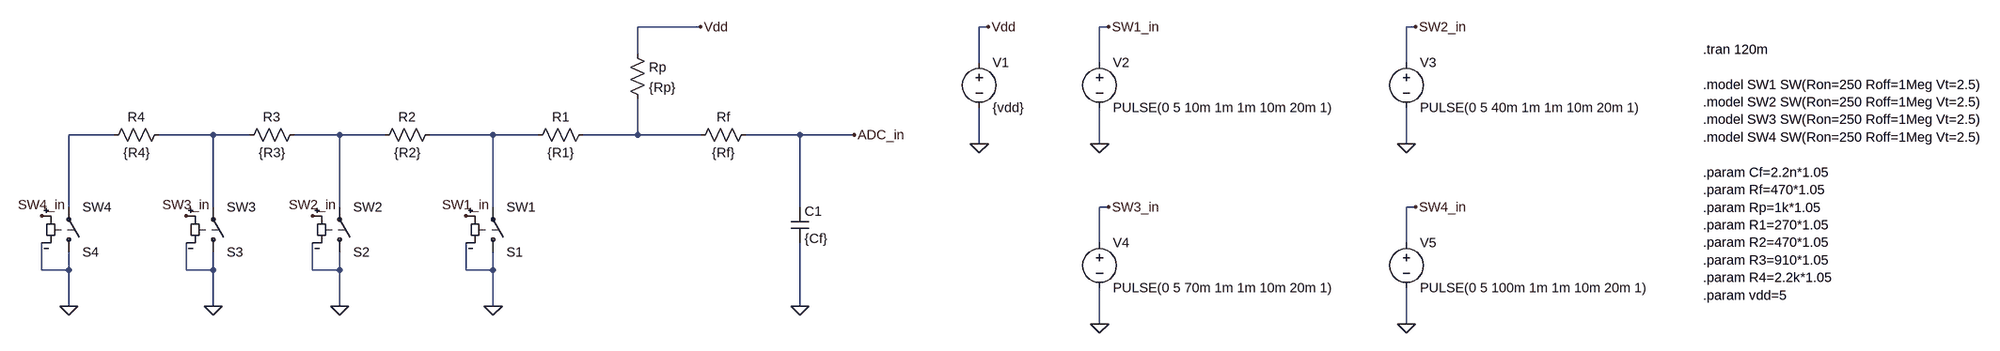
[diagram p0: schematic SwitchOnOffSim.asc]
SwitchOnOffSim.asc, the LTspice schematic file:
Version 4
SHEET 1 2840 756
WIRE 416 192 304 192
WIRE 944 192 928 192
WIRE 1184 192 1168 192
WIRE 1728 192 1712 192
WIRE 304 240 304 192
WIRE 928 256 928 192
WIRE 1168 256 1168 192
WIRE 1712 256 1712 192
WIRE -624 384 -704 384
WIRE -448 384 -544 384
WIRE -384 384 -448 384
WIRE -224 384 -304 384
WIRE -144 384 -224 384
WIRE 48 384 -64 384
WIRE 128 384 48 384
WIRE 304 384 304 320
WIRE 304 384 208 384
WIRE 416 384 304 384
WIRE 592 384 496 384
WIRE 688 384 592 384
WIRE 928 400 928 336
WIRE 1168 400 1168 336
WIRE 1712 400 1712 336
WIRE -704 512 -704 384
WIRE -448 512 -448 384
WIRE -224 512 -224 384
WIRE 48 512 48 384
WIRE 592 512 592 384
WIRE 1184 512 1168 512
WIRE 1728 512 1712 512
WIRE 1168 576 1168 512
WIRE 1712 576 1712 512
WIRE -752 624 -752 576
WIRE -704 624 -704 592
WIRE -704 624 -752 624
WIRE -496 624 -496 576
WIRE -448 624 -448 592
WIRE -448 624 -496 624
WIRE -272 624 -272 576
WIRE -224 624 -224 592
WIRE -224 624 -272 624
WIRE 0 624 0 576
WIRE 48 624 48 592
WIRE 48 624 0 624
WIRE -704 688 -704 624
WIRE -448 688 -448 624
WIRE -224 688 -224 624
WIRE 48 688 48 624
WIRE 592 688 592 576
WIRE 1168 720 1168 656
WIRE 1712 720 1712 656
FLAG 416 192 Vdd
FLAG 688 384 ADC_in
FLAG 48 688 0
FLAG -224 688 0
FLAG -448 688 0
FLAG -704 688 0
FLAG 592 688 0
FLAG 928 400 0
FLAG 944 192 Vdd
FLAG 0 528 SW1_in
FLAG -272 528 SW2_in
FLAG -496 528 SW3_in
FLAG -752 528 SW4_in
FLAG 1168 400 0
FLAG 1184 192 SW1_in
FLAG 1712 400 0
FLAG 1728 192 SW2_in
FLAG 1168 720 0
FLAG 1184 512 SW3_in
FLAG 1712 720 0
FLAG 1728 512 SW4_in
SYMBOL res 288 224 R0
SYMATTR InstName Rp
SYMATTR Value {Rp}
SYMBOL res 224 368 R90
WINDOW 0 0 56 VBottom 2
WINDOW 3 32 56 VTop 2
SYMATTR InstName R1
SYMATTR Value {R1}
SYMBOL res -48 368 R90
WINDOW 0 0 56 VBottom 2
WINDOW 3 32 56 VTop 2
SYMATTR InstName R2
SYMATTR Value {R2}
SYMBOL res -288 368 R90
WINDOW 0 0 56 VBottom 2
WINDOW 3 32 56 VTop 2
SYMATTR InstName R3
SYMATTR Value {R3}
SYMBOL res -528 368 R90
WINDOW 0 0 56 VBottom 2
WINDOW 3 32 56 VTop 2
SYMATTR InstName R4
SYMATTR Value {R4}
SYMBOL res 512 368 R90
WINDOW 0 0 56 VBottom 2
WINDOW 3 32 56 VTop 2
SYMATTR InstName Rf
SYMATTR Value {Rf}
SYMBOL cap 576 512 R0
SYMATTR InstName C1
SYMATTR Value {Cf}
SYMBOL sw 48 608 M180
SYMATTR InstName S1
SYMATTR Value SW1
SYMBOL sw -224 608 M180
SYMATTR InstName S2
SYMATTR Value SW2
SYMBOL sw -448 608 M180
SYMATTR InstName S3
SYMATTR Value SW3
SYMBOL sw -704 608 M180
SYMATTR InstName S4
SYMATTR Value SW4
SYMBOL voltage 928 240 R0
WINDOW 123 0 0 Left 0
WINDOW 39 0 0 Left 0
SYMATTR InstName V1
SYMATTR Value {vdd}
SYMBOL voltage 1168 240 R0
WINDOW 123 0 0 Left 0
WINDOW 39 0 0 Left 0
SYMATTR InstName V2
SYMATTR Value PULSE(0 5 10m 1m 1m 10m 20m 1)
SYMBOL voltage 1712 240 R0
WINDOW 123 0 0 Left 0
WINDOW 39 0 0 Left 0
SYMATTR InstName V3
SYMATTR Value PULSE(0 5 40m 1m 1m 10m 20m 1)
SYMBOL voltage 1168 560 R0
WINDOW 123 0 0 Left 0
WINDOW 39 0 0 Left 0
SYMATTR InstName V4
SYMATTR Value PULSE(0 5 70m 1m 1m 10m 20m 1)
SYMBOL voltage 1712 560 R0
WINDOW 123 0 0 Left 0
WINDOW 39 0 0 Left 0
SYMATTR InstName V5
SYMATTR Value PULSE(0 5 100m 1m 1m 10m 20m 1)
TEXT 2304 232 Left 2 !.tran 120m\n \n.model SW1 SW(Ron=250 Roff=1Meg Vt=2.5)\n.model SW2 SW(Ron=250 Roff=1Meg Vt=2.5)\n.model SW3 SW(Ron=250 Roff=1Meg Vt=2.5)\n.model SW4 SW(Ron=250 Roff=1Meg Vt=2.5)\n \n.param Cf=2.2n*1.05\n.param Rf=470*1.05\n.param Rp=1k*1.05\n.param R1=270*1.05\n.param R2=470*1.05\n.param R3=910*1.05\n.param R4=2.2k*1.05\n.param vdd=5

The netlist it stands for:
* SwitchOnOffSim.asc
Rp Vdd N005 {Rp}
R1 N005 N004 {R1}
R2 N004 N003 {R2}
R3 N003 N002 {R3}
R4 N002 N001 {R4}
Rf ADC_in N005 {Rf}
C1 ADC_in 0 {Cf}
S1 0 N004 SW1_in 0 SW1
S2 0 N003 SW2_in 0 SW2
S3 0 N002 SW3_in 0 SW3
S4 0 N001 SW4_in 0 SW4
V1 Vdd 0 {vdd}
V2 SW1_in 0 PULSE(0 5 10m 1m 1m 10m 20m 1)
V3 SW2_in 0 PULSE(0 5 40m 1m 1m 10m 20m 1)
V4 SW3_in 0 PULSE(0 5 70m 1m 1m 10m 20m 1)
V5 SW4_in 0 PULSE(0 5 100m 1m 1m 10m 20m 1)
.tran 120m
.model SW1 SW(Ron=250 Roff=1Meg Vt=2.5)
.model SW2 SW(Ron=250 Roff=1Meg Vt=2.5)
.model SW3 SW(Ron=250 Roff=1Meg Vt=2.5)
.model SW4 SW(Ron=250 Roff=1Meg Vt=2.5)
.param Cf=2.2n*1.05
.param Rf=470*1.05
.param Rp=1k*1.05
.param R1=270*1.05
.param R2=470*1.05
.param R3=910*1.05
.param R4=2.2k*1.05
.param vdd=5
.backanno
.end